# EAGLE design lcd-bracket (EAGLE 6.1)
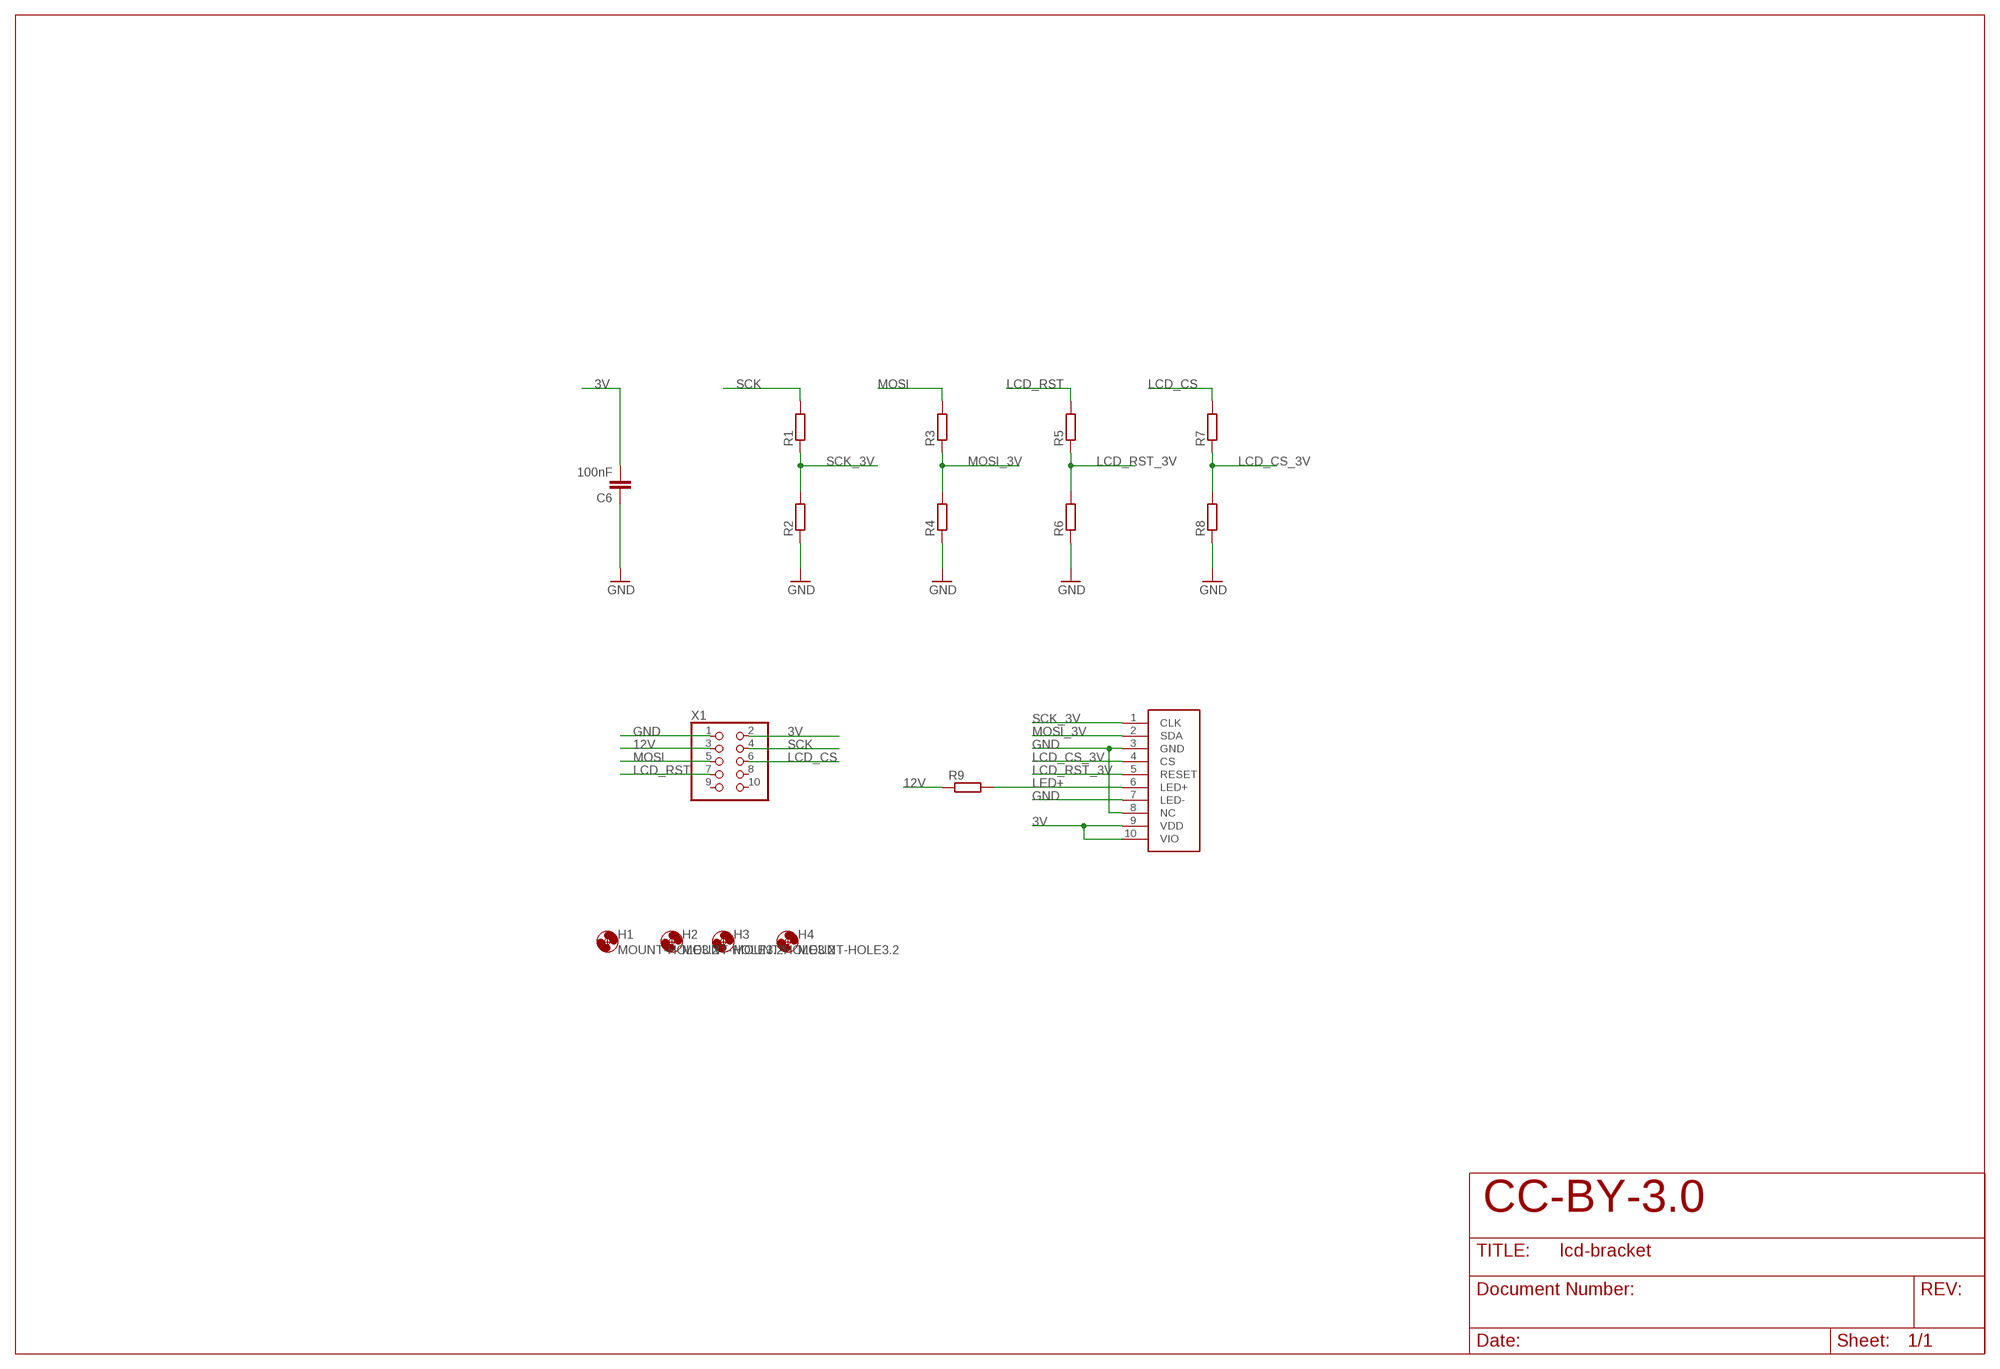
[diagram p0: schematic, sheet 1]

## Parts
C6  100nF  C-EUC0603K  [C0603K]
H1  MOUNT-HOLE3.2  [3,2]
H2  MOUNT-HOLE3.2  [3,2]
H3  MOUNT-HOLE3.2  [3,2]
H4  MOUNT-HOLE3.2  [3,2]
R1  R-EU_R0603  [R0603]
R2  R-EU_R0603  [R0603]
R3  R-EU_R0603  [R0603]
R4  R-EU_R0603  [R0603]
R5  R-EU_R0603  [R0603]
R6  R-EU_R0603  [R0603]
R7  R-EU_R0603  [R0603]
R8  R-EU_R0603  [R0603]
R9  R-EU_R1206  [R1206]
X1  PINHD-2X5  [2X05]
X2  NOKIA  [DF23]

## Nets
3V: C6.2 X1.2 X2.9(VDD) X2.10(VIO)
12V: R9.1 X1.3
GND [GND/3V3]: C6.1 R2.1 R4.1 R6.1 R8.1 X1.1 X2.3(GND) X2.7(LED-) X2.8(NC)
LCD_CS: R7.2 X1.6
LCD_CS_3V: R7.1 R8.2 X2.4(CS)
LCD_RST: R5.2 X1.7
LCD_RST_3V: R5.1 R6.2 X2.5(RESET)
LED+: R9.2 X2.6(LED+)
MOSI: R3.2 X1.5
MOSI_3V: R3.1 R4.2 X2.2(SDA)
SCK: R1.2 X1.4
SCK_3V: R1.1 R2.2 X2.1(CLK)
Unconnected: X1.8 X1.9 X1.10

## Notes on the sheet
- CC-BY-3.0

## Library data of the parts
C6 = rcl:C-EU: CAPACITOR, European symbol
H1-H4 = holes:MOUNT-HOLE: MOUNTING HOLE with drill center marker
R1-R9 = resistor:R-EU_: RESISTOR, European symbol
X1 = pinhead:PINHD-2X5: PIN HEADER
X2 = badge:NOKIA

## Net classes
1 FAT: width 0.2 mm, drill 0.4 mm
2 GND/3V3: width 0.2 mm, drill 0.4 mm

## Board
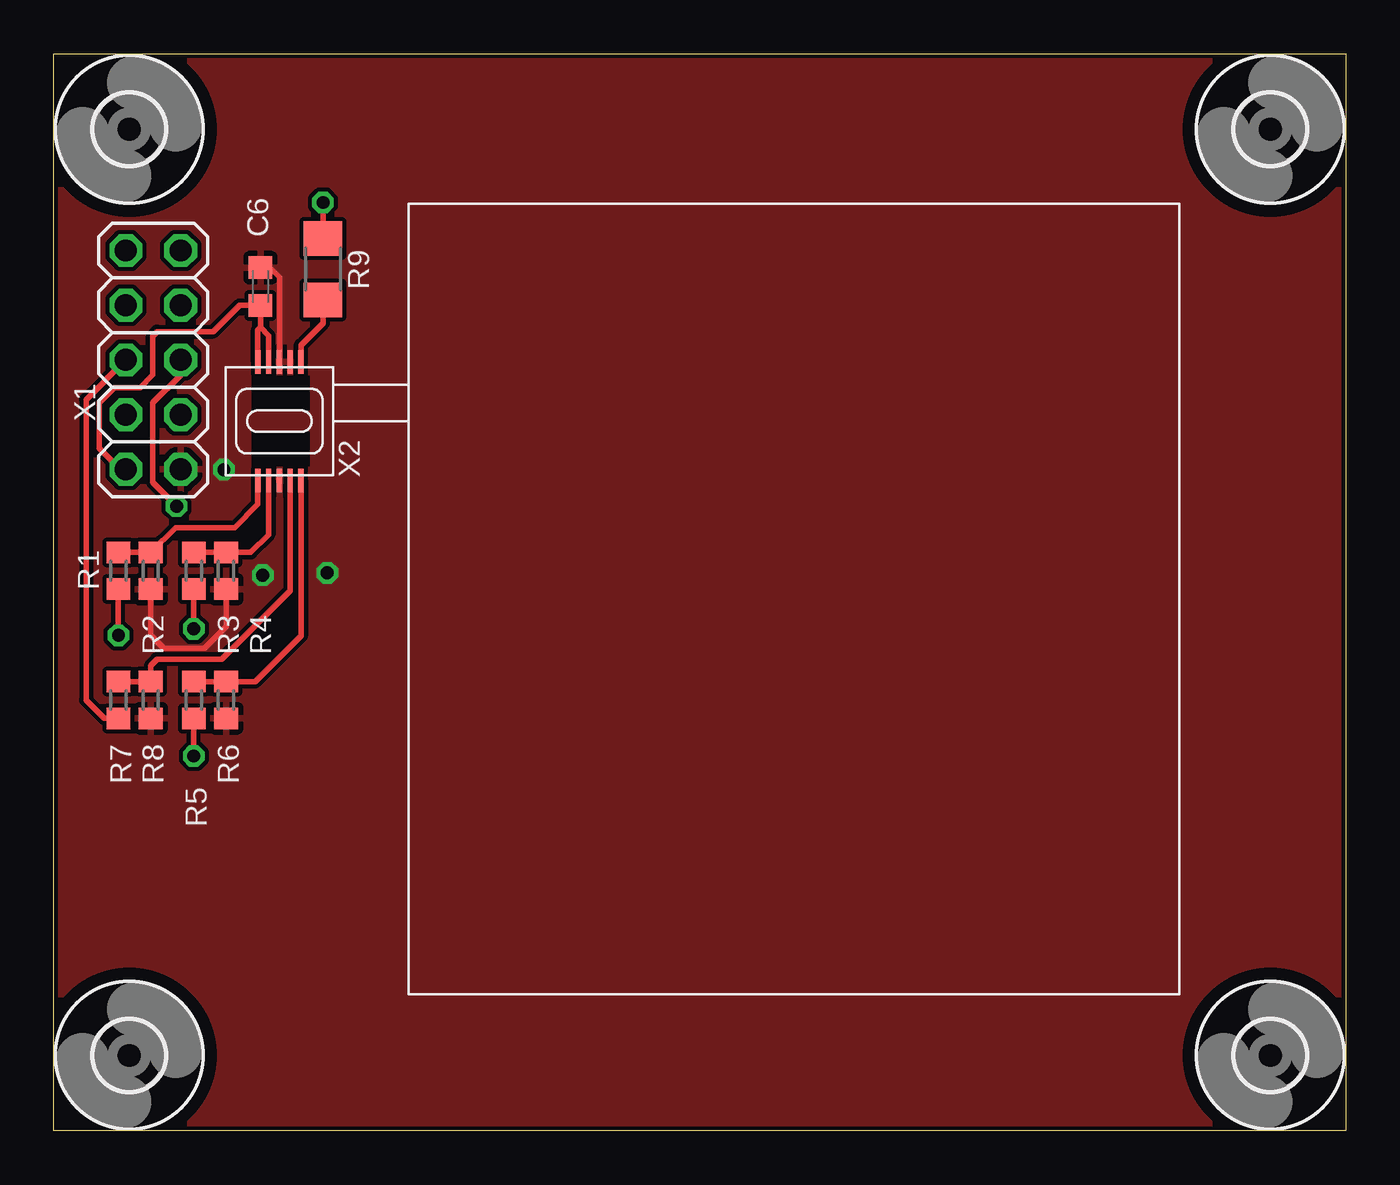
[diagram p1: board, top side]
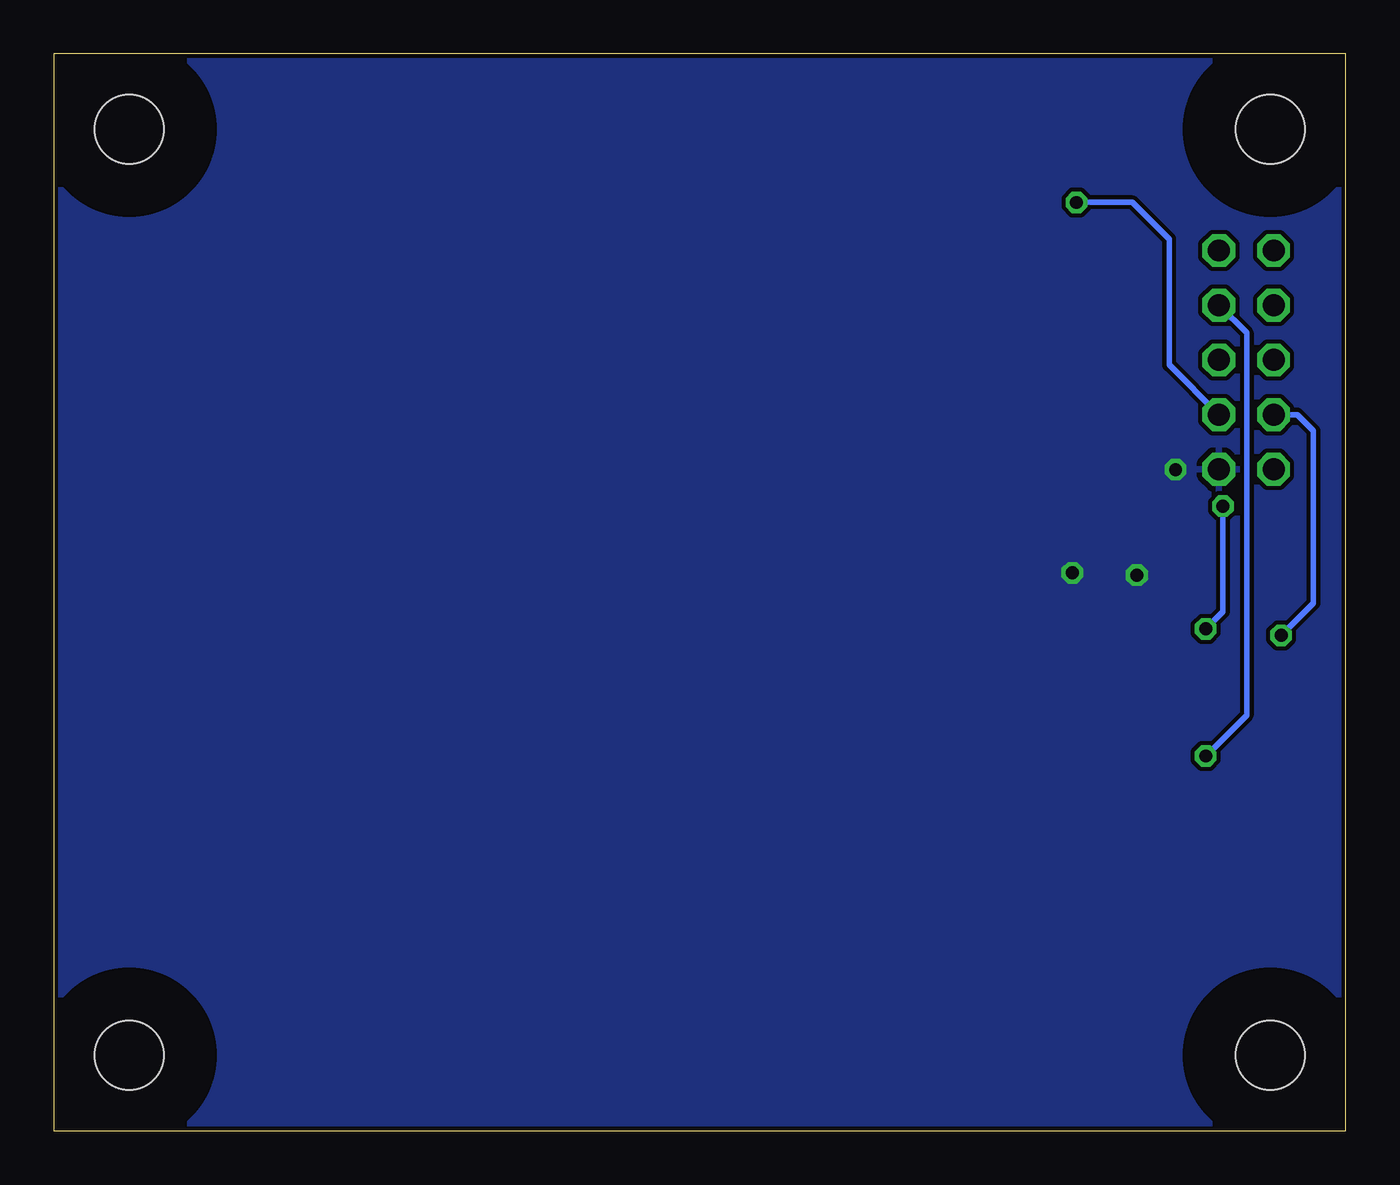
[diagram p2: board, bottom side, seen from below]

Size 60 x 50 mm. Coordinates in mm from the lower left corner, seen from the top.
Outline: 0,50 60,50 60,0 0,0 0,50
Copper layers (1*16): Top 0.035mm / dielectric 1.5mm / Bottom 0.035mm
Design rules: minimum track width 0.2mm, minimum drill 0.4mm, track to track 0.2mm, track to pad 6mil, pad to pad 6mil, via to via 0.2mm, smd to smd 6mil, copper to edge 0.2mm, drill to drill 8mil, minimum pad ring 8mil, minimum via ring 0.2mm, stop-mask expansion 4mil, vias tented up to drill 0.4mm, thermal gap 10mil

### Footprints (pad centres in the part's own frame; a part is rotated, then mirrored left to right if it is on the bottom)
C0603K = smd 1.05 x 1.08: 1 -0.875,0; 2 0.875,0
3,2 = hole 3.2: 0,0
R0603 = smd 1 x 1.1: 1 -0.85,0; 2 0.85,0
R1206 = smd 1.6 x 1.803: 1 -1.422,0; 2 1.422,0
2X05 = drill 1.016 octagon: 1 -5.08,-1.27; 2 -5.08,1.27; 3 -2.54,-1.27; 4 -2.54,1.27; 5 0,-1.27; 6 0,1.27; 7 2.54,-1.27; 8 2.54,1.27; 9 5.08,-1.27; 10 5.08,1.27
DF23 = smd 0.25 x 1.1: 1 1,2.75; 2 0.5,2.75; 3 0,2.75; 4 -0.5,2.75; 5 -1,2.75; 6 -1,-2.75; 7 -0.5,-2.75; 8 0,-2.75; 9 0.5,-2.75; 10 1,-2.75

### Placement (x,y rotation side)
C6  9.6,39.2 270 top
H1  3.5,46.5 0 top
H2  56.5,3.5 0 top
H3  56.5,46.5 0 top
H4  3.5,3.5 0 top
R1  3,26 270 top
R2  4.5,26 90 top
R3  6.5,26 270 top
R4  8,26 90 top
R5  6.5,20 270 top
R6  8,20 90 top
R7  3,20 270 top
R8  4.5,20 90 top
R9  12.5,40 270 top
X1  4.62,35.79 90 top
X2  10.48,32.95 180 top

### Tracks (layer width: path | path; a pad name or v marks a point on that pad's centre or on a via)
3V
  Top 0.254: X2.9 9.98,36.92 9.6,37.3 | X2.10 9.48,37.18 9.6,37.3 | 9.6,37.3 C6.2 8.62,38.33 7.4,37.1 4.8,37.1 4.6,36.9 4.6,35.1 4,34.5 2.8,34.5 2.1,33.8 2.1,31.7 3.09,30.71 X1.2
12V  (via drill 0.6)
  Top 0.254: v12.5,43.1 R9.1
  Bottom 0.254: X1.3 8.2,35.56 8.2,41.4 9.9,43.1 v12.5,43.1
GND  (via drill 0.6)
  Top 0.254: X2.8 10.48,39.62 10.03,40.08 C6.1 | 4.5,25.5 R2.1 4.5,23 5.1,22.4 7,22.4 8,23.4 R4.1
  other vias: 9.7,25.8 12.7,25.9 7.9,30.7
  pour Bottom: 76.1,55.7 74.1,-7.3 -6,-6 -3.7,56.2
  pour Top: 77.1,56.7 80.8,2.1 78.1,-8.3 -10,-8 -3.6,55.5
LCD_CS
  Top 0.254: X1.6 1.5,33.94 1.5,20 2.35,19.15 R7.2
LCD_CS_3V
  Top 0.254: X2.4 10.98,25.08 7.8,21.9 4.8,21.9 4.5,21.6 R8.2 R7.1
LCD_RST  (via drill 0.6)
  Top 0.254: v6.5,17.4 R5.2
  Bottom 0.254: X1.7 4.6,37.04 4.6,19.3 v6.5,17.4
LCD_RST_3V
  Top 0.254: R5.1 R6.2 9.35,20.85 11.48,22.98 X2.5
LED+
  Top 0.254: X2.6 11.48,36.48 12.5,37.5 R9.2
MOSI  (via drill 0.6)
  Top 0.254: 6.45,25.2 R3.2 v6.5,23.3 | v5.7,29 4.6,30.1 4.6,33.8 5.89,35.09 X1.5
  Bottom 0.254: v5.7,29 5.7,24.1 v6.5,23.3
MOSI_3V
  Top 0.254: X2.2 9.98,27.68 9.15,26.85 R4.2 R3.1
SCK  (via drill 0.6)
  Top 0.254: v3,23 R1.2
  Bottom 0.254: X1.4 2.25,33.25 1.5,32.5 1.5,24.5 v3,23
SCK_3V
  Top 0.254: R1.1 R2.2 5.65,28 8.4,28 9.48,29.08 X2.1